# EAGLE design Power-Final (EAGLE 9.5.2)
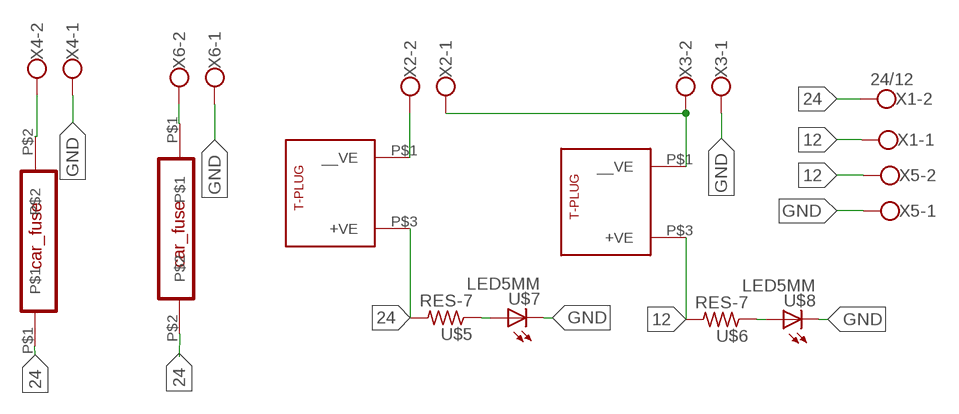
[diagram p0: schematic, sheet 1]

## Parts
U$1  CAR_FUSE  [CAR_FUSE]
U$2  CAR_FUSE  [CAR_FUSE]
U$3  T_CONNECTOR  [T-PLUG]
U$4  T_CONNECTOR  [T-PLUG]
U$5  RES-7  [0204/7]
U$6  RES-7  [0204/7]
U$7  LED5MM  [LED5MM]
U$8  LED5MM  [LED5MM]
X1  24/12  ROSTA.POWER  [W239-302]
X2  ROSTA.POWER  [W239-302]
X3  ROSTA.POWER  [W239-302]
X4  ROSTA.POWER  [W239-302]
X5  ROSTA.POWER  [W239-302]
X6  ROSTA.POWER  [W239-302]

## Nets
12: U$4.P$3(+VE) U$6.2 X1.1 X5.2
24: U$1.P$1 U$2.P$2 U$3.P$3(+VE) U$5.2 X1.2
GND: U$7.K(C) U$8.K(C) X3.1 X4.1 X5.1 X6.1
N$1: U$3.P$1(__VE) X2.2
N$2: U$2.P$1 X6.2
N$3: U$5.1 U$7.A
N$5: U$4.P$1(__VE) X2.1 X3.2
N$7: U$6.1 U$8.A
N$9: U$1.P$2 X4.2

## Library data of the parts
U$1 U$2 = MIA_LIBRARY-2-2-2:CAR_FUSE
U$3 U$4 = MIA_LIBRARY-2-2-2:T_CONNECTOR
U$5 U$6 = MIA_LIBRARY-2-2-2:RES-7
U$7 U$8 = MIA_LIBRARY-2-2-2:LED5MM
X1-X6 = MIA_LIBRARY-2-2-2:ROSTA.POWER: WAGO SCREW CLAMP; OC_FARNELL: unknown; OC_NEWARK: unknown

## Board
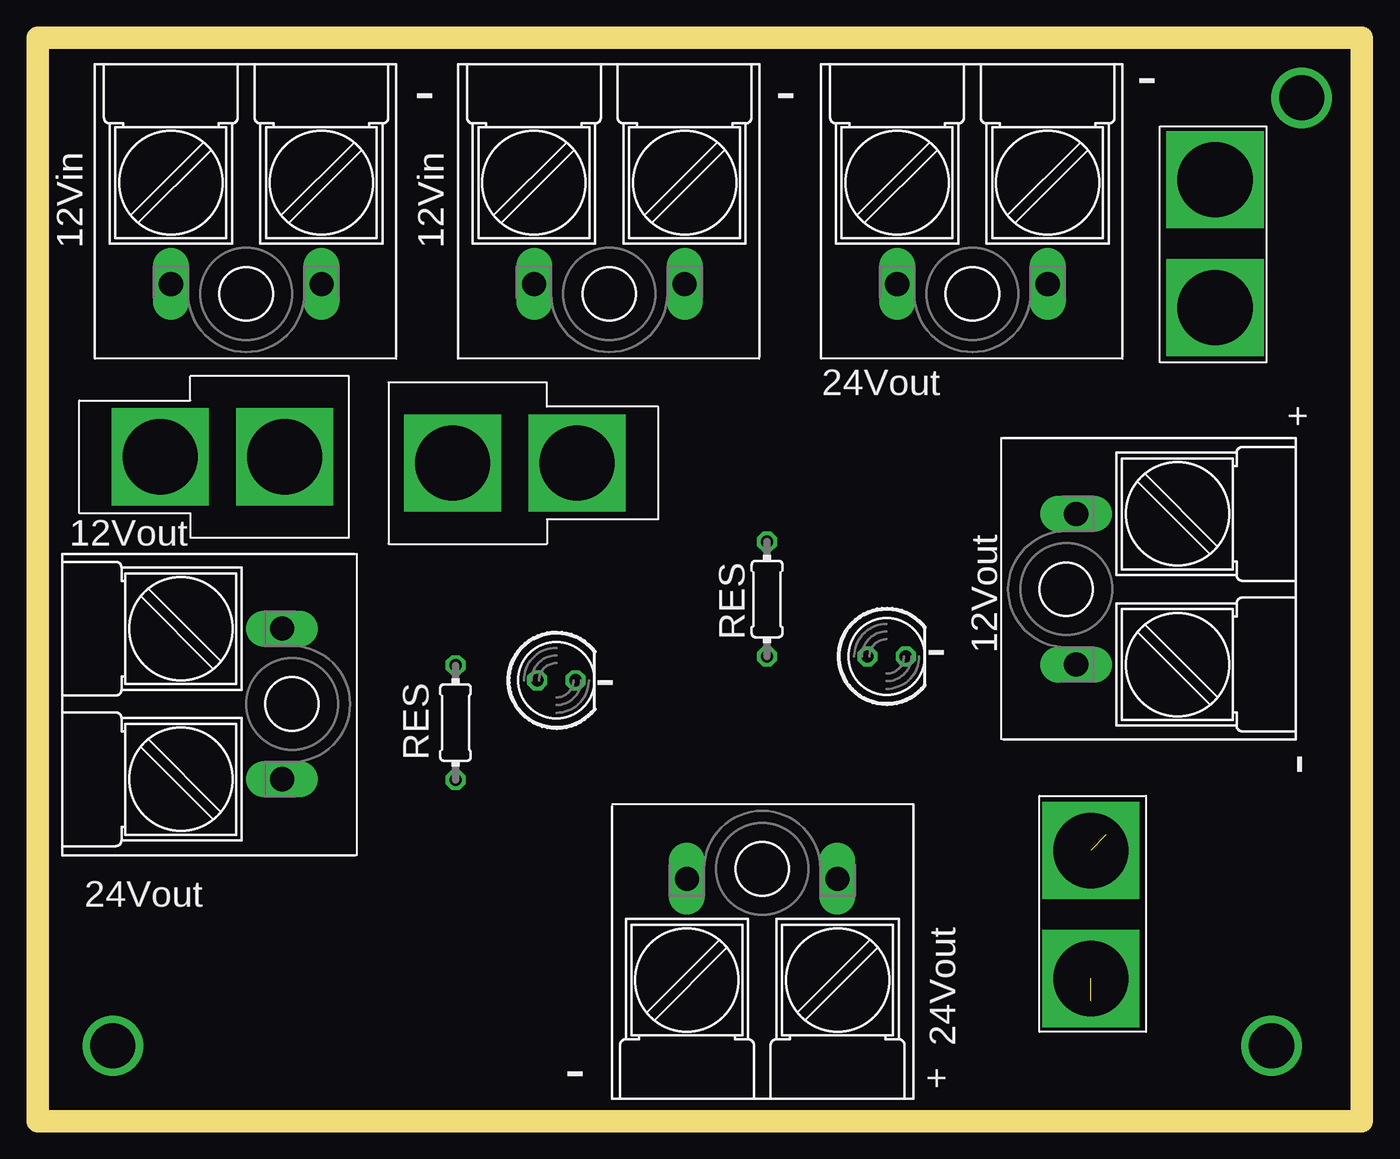
[diagram p1: board, top side]
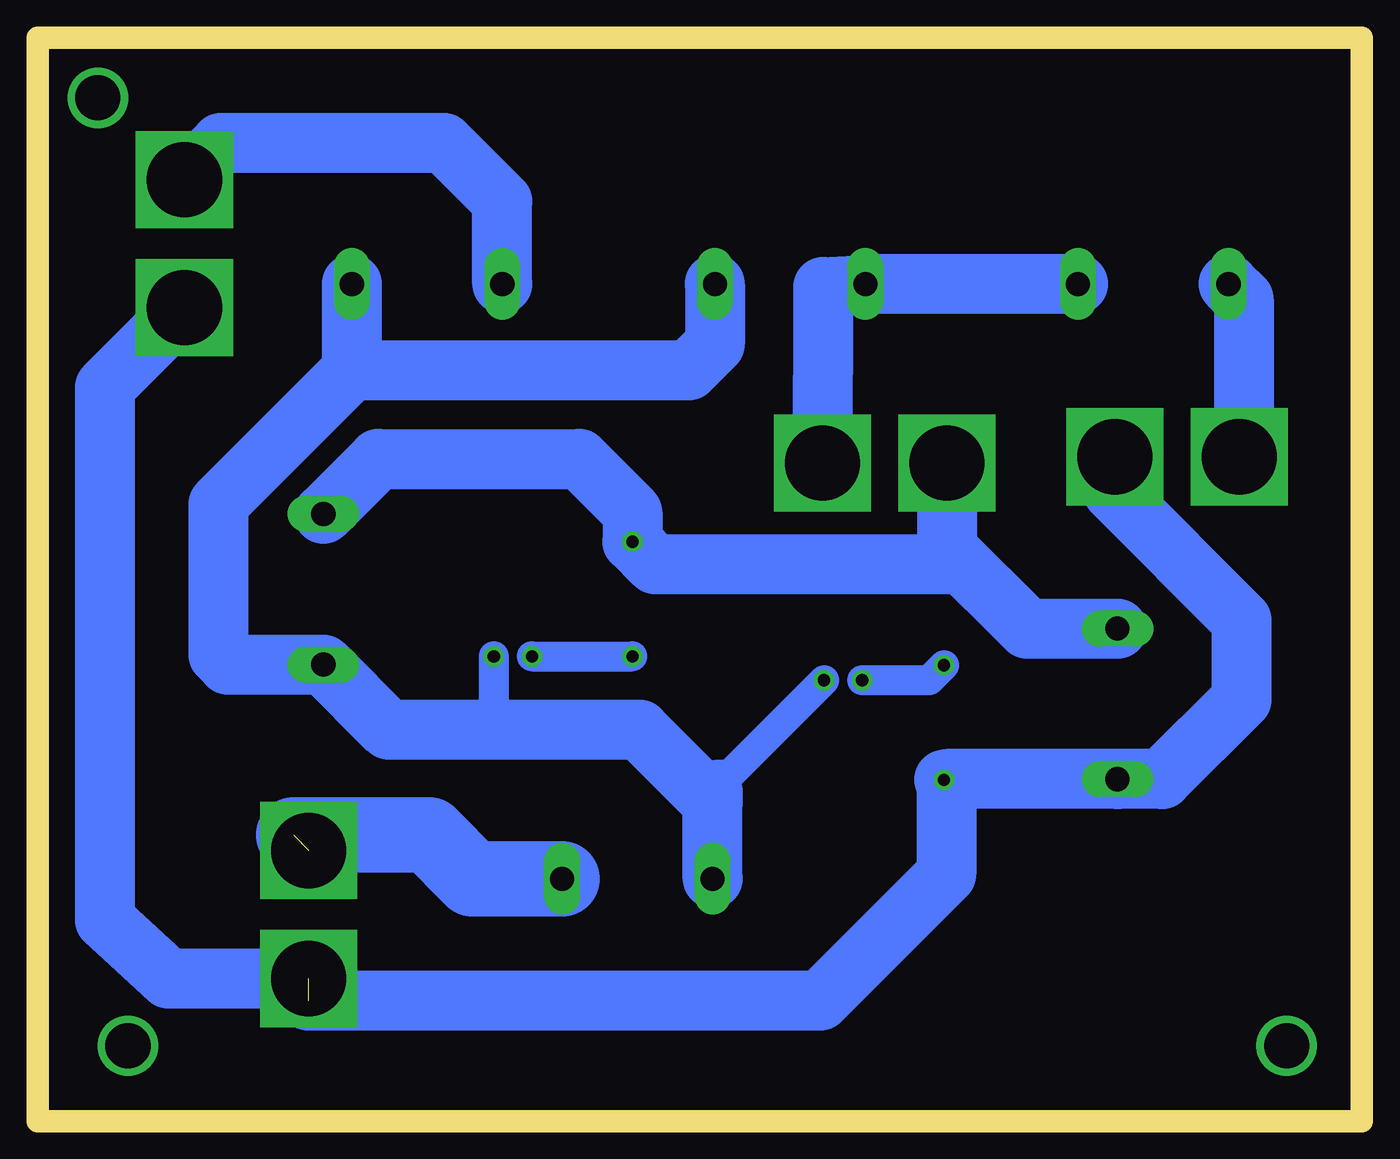
[diagram p2: board, bottom side, seen from below]

Size 88 x 72 mm. Coordinates in mm from the lower left corner, seen from the top.
Outline: 0,0 88,0 88,72 0,72 0,0
Copper layers (1*16): Top 0.035mm / dielectric 1.5mm / Bottom 0.035mm
Design rules "default": minimum track width 6mil, minimum drill 0.35mm, track to track 6mil, track to pad 6mil, pad to pad 6mil, via to via 6mil, smd to smd 6mil, copper to edge 40mil, drill to drill 6mil, minimum pad ring 10mil, minimum via ring 8mil, stop-mask expansion 4mil, vias tented up to drill 0mil, thermal gap 10mil

### Footprints (pad centres in the part's own frame; a part is rotated, then mirrored left to right if it is on the bottom)
CAR_FUSE = drill 5 pad 6.452 square: P$1 2.794,-0.127; P$2 11.303,-0.127
T-PLUG = drill 5 pad 6.452 square: P$1 -2.73,-4; P$3 -11,-4
0204/7 = drill 0.813 octagon: 1 -3.81,0; 2 3.81,0
LED5MM = drill 0.813 octagon: A -1.27,0; K 1.27,0
W239-302 = drill 1.6 long: 1 -5,5; 2 5,5

### Placement (x,y rotation side)
U$1  78.12,51.26 90 top
U$2  70.12,20.77 270 top
U$3  5.42,40.14 180 top
U$4  38.58,47.72 0 top
U$5  27.77,26.48 270 top
U$6  48.47,34.69 90 top
U$7  34.47,29.29 0 top
U$8  56.42,30.88 0 top
X1  11.24,27.72 270 top
X2  13.86,60.63 180 top
X3  37.99,60.63 180 top
X4  62.12,60.63 180 top
X5  74.01,35.34 90 top
X6  48.15,11.1 0 top

### Tracks (layer width: path | path; a pad name or v marks a point on that pad's centre or on a via)
12
  Bottom 4: X1.1 22.24,32.72 27.58,38.06 U$4.P$3 27.58,37 46.97,37 U$6.2 48.47,40.47 52,44 65.35,44 X5.2
24  (1 unrouted)
  Bottom 4: U$3.P$3 16.42,41.93 16.53,41.81 8,33.28 8,28 13.28,22.72 X1.2 27.61,22.72 | U$5.2 27.61,22.72 | U$1.P$1 83.53,48.77 83.53,13.37 79.32,9.47 U$2.P$2 | 27.61,22.72 27.61,16.39 36,8 70,8
GND
  Bottom 2: U$7.K 42.03,23 43,23 43.15,22.85 43.15,21.15 | U$8.K 57.69,26.31
  Bottom 4: X4.1 67.12,49.88 | 67.12,49.88 76,41 76,31 75.34,30.34 X5.1 64.67,26 58,26 | X3.1 42.99,51.63 44.74,49.88 67.12,49.88 | X6.1 43.15,21.15 | 43.15,21.15 48,26 58,26 | 57.69,26.31 58,26 | 43.15,21.88 43.15,21.15
N$1
  Bottom 4: X2.2 7.86,54.63 7.86,44.43 U$3.P$1
N$2  (1 unrouted)
  Bottom 5: X6.2 59.1,16.1 62,19 71,19
N$3
  Bottom 2: U$5.1 28.77,29.29 U$7.A
N$4  (via drill 3)
  other vias: 84,68
N$5
  Bottom 4: X2.1 X3.2 32.99,55.57 35.81,55.42 U$4.P$1
N$6  (via drill 3)
  other vias: 5,5
N$7
  Bottom 2: U$8.A U$6.1
N$8  (via drill 3)
  other vias: 82,5
N$9
  Bottom 4: X4.2 57.12,61.12 61,65 75.81,65 U$1.P$2

### Text on the board
tNames: - | - | - | 12Vin | 12Vin | 24Vout | + | 12Vout | 12Vout | RES | - | - | RES | - | 24Vout | 24Vout | - | +